# Altium schematic sheet Sound_Card_LED_Monitor.SchDoc: Sound Card LED Monitor
size Tabloid; Date: 05/10/2023; Engineer: Terry D. Schevker; Revision: 1.0; SheetNumber: 4; SheetTotal: 4
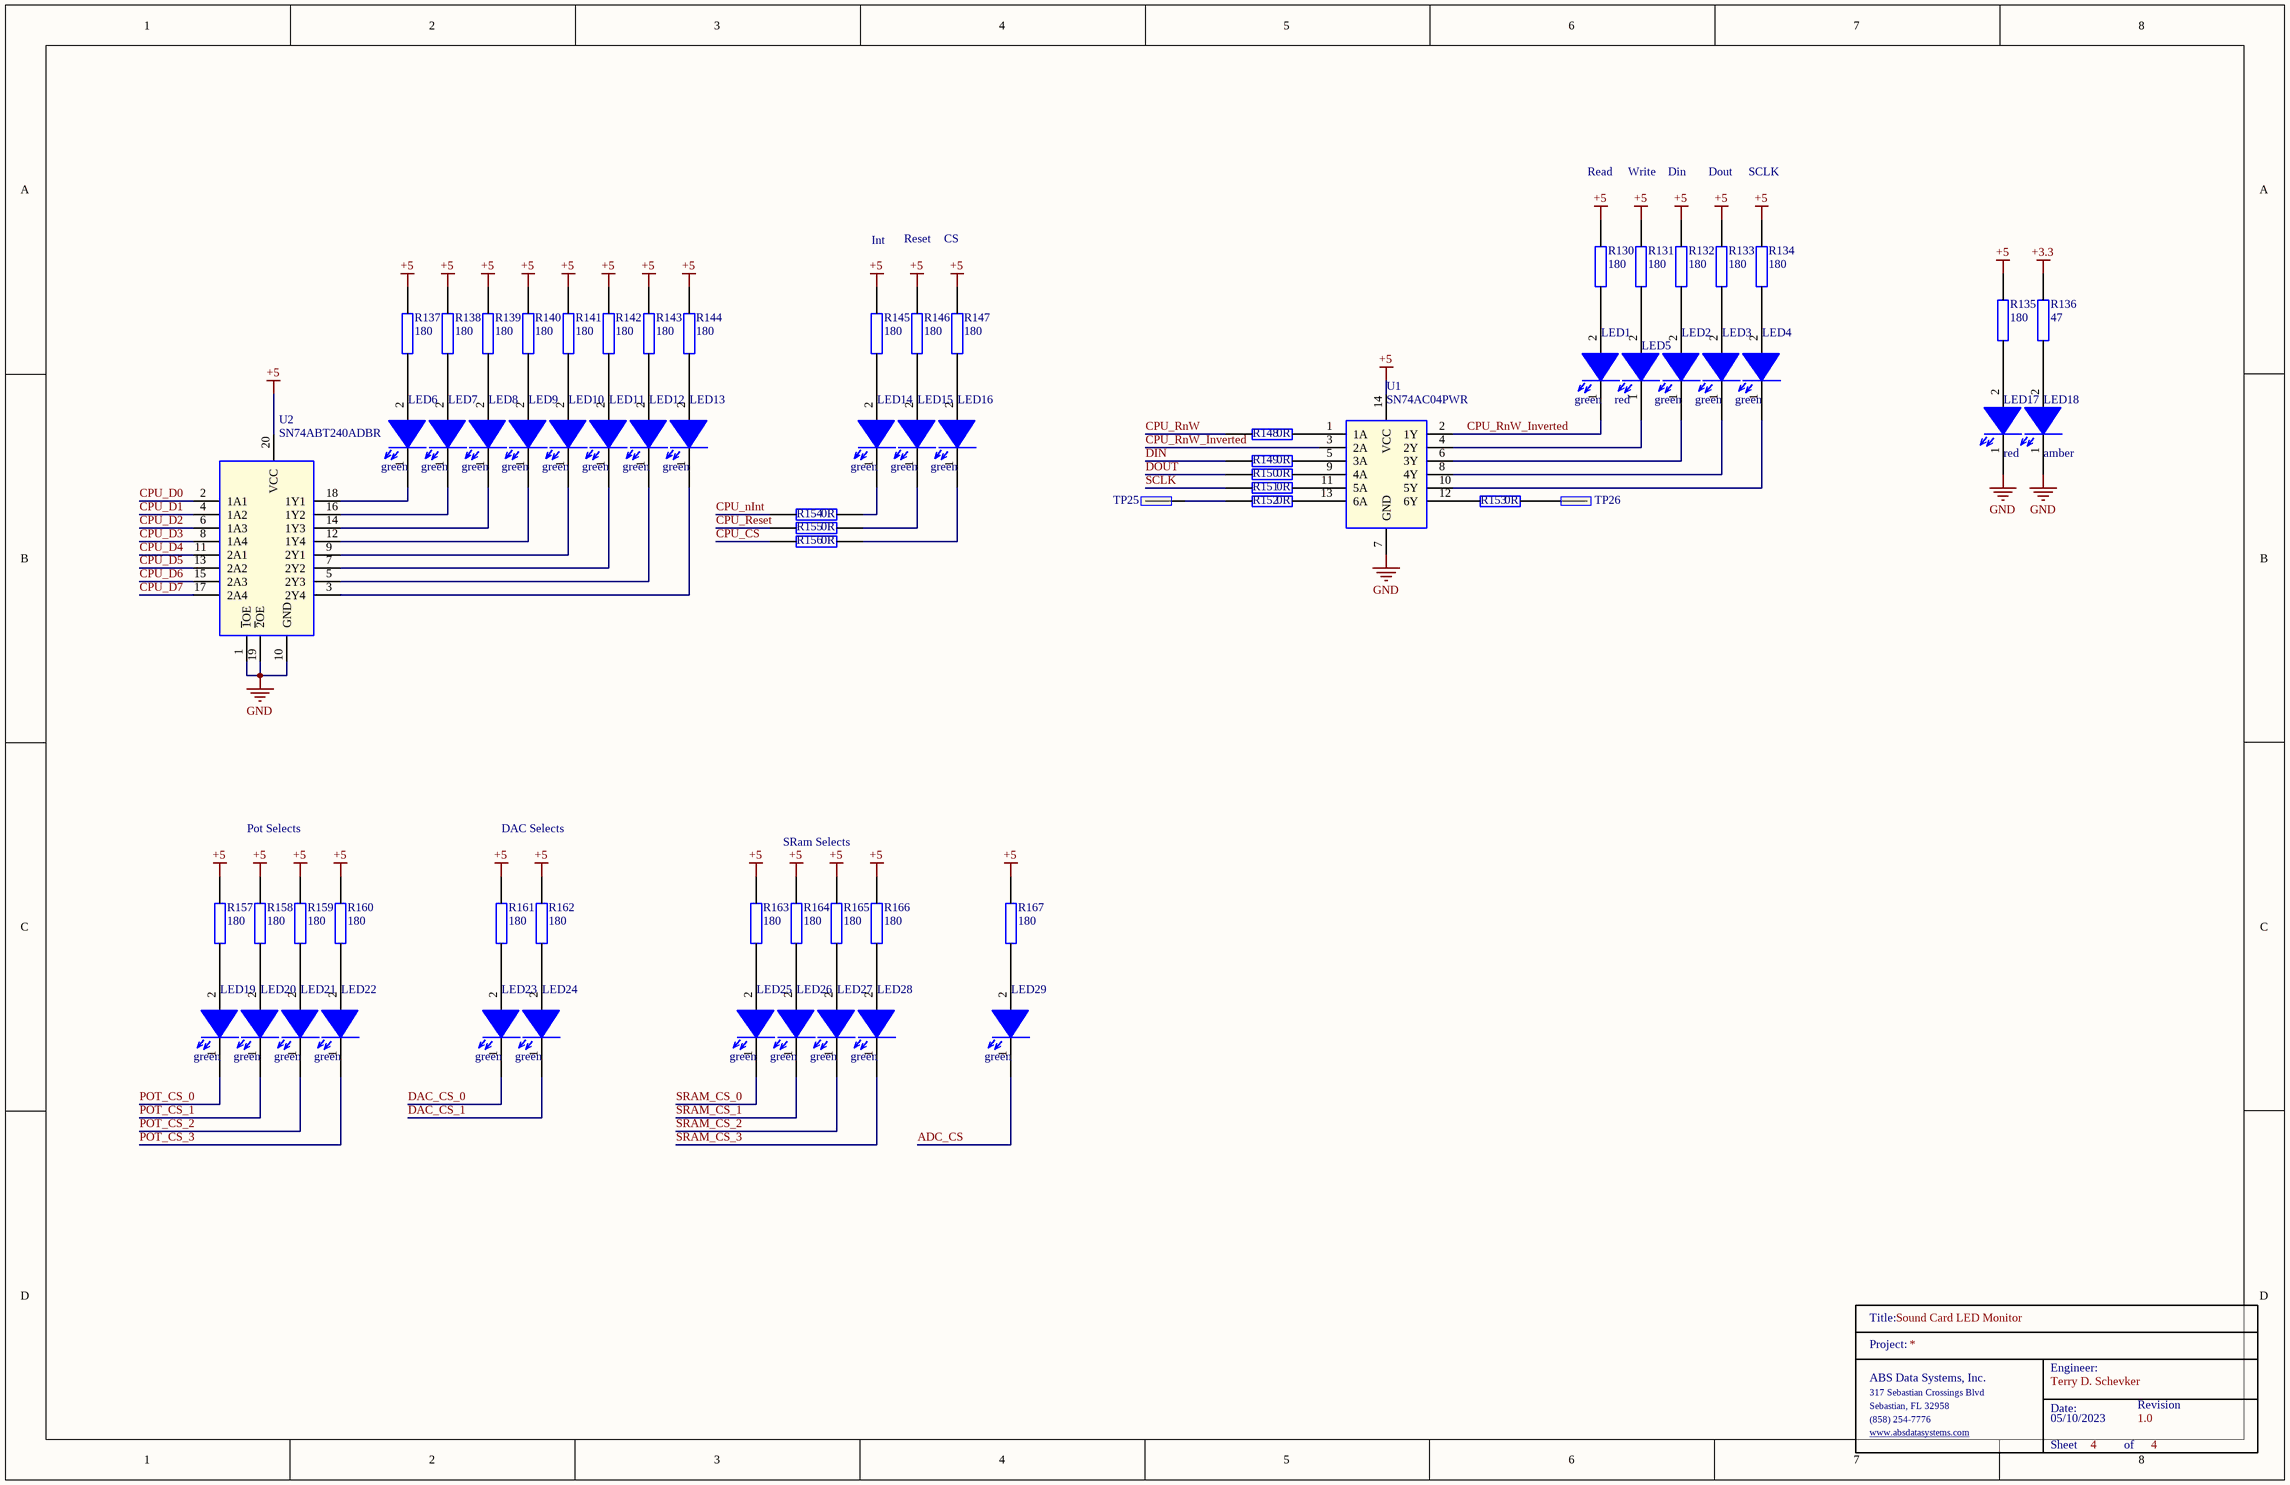
[diagram p0: Sound_Card_LED_Monitor.SchDoc]

## Parts
LED1  green  [0603_Diode]
LED2  green  [0603_Diode]
LED3  green  [0603_Diode]
LED4  green  [0603_Diode]
LED5  red  [0603_Diode]
LED6  green  [0603_Diode]
LED7  green  [0603_Diode]
LED8  green  [0603_Diode]
LED9  green  [0603_Diode]
LED10  green  [0603_Diode]
LED11  green  [0603_Diode]
LED12  green  [0603_Diode]
LED13  green  [0603_Diode]
LED14  green  [0603_Diode]
LED15  green  [0603_Diode]
LED16  green  [0603_Diode]
LED17  red  [0603_Diode]
LED18  amber  [0603_Diode]
LED19  green  [0603_Diode]
LED20  green  [0603_Diode]
LED21  green  [0603_Diode]
LED22  green  [0603_Diode]
LED23  green  [0603_Diode]
LED24  green  [0603_Diode]
LED25  green  [0603_Diode]
LED26  green  [0603_Diode]
LED27  green  [0603_Diode]
LED28  green  [0603_Diode]
LED29  green  [0603_Diode]
R130  180  [0603]
R131  180  [0603]
R132  180  [0603]
R133  180  [0603]
R134  180  [0603]
R135  180  [0603]
R136  47  [0603]
R137  180  [0603]
R138  180  [0603]
R139  180  [0603]
R140  180  [0603]
R141  180  [0603]
R142  180  [0603]
R143  180  [0603]
R144  180  [0603]
R145  180  [0603]
R146  180  [0603]
R147  180  [0603]
R148  0R  [0603]
R149  0R  [0603]
R150  0R  [0603]
R151  0R  [0603]
R152  0R  [0603]
R153  0R  [0603]
R154  0R  [0603]
R155  0R  [0603]
R156  0R  [0603]
R157  180  [0603]
R158  180  [0603]
R159  180  [0603]
R160  180  [0603]
R161  180  [0603]
R162  180  [0603]
R163  180  [0603]
R164  180  [0603]
R165  180  [0603]
R166  180  [0603]
R167  180  [0603]
TitleBlock_?  TitleBlock  (value not drawn)  (graphical)
TP25  TP  [TP]  (value not drawn)
TP26  TP  [TP]  (value not drawn)
U1  SN74AC04PWR  [SOP65P640X120-14N]
U2  SN74ABT240ADBR  [SOP65P780X200-20N]

## Nets
+3.3: R136.1
+5: R130.2 R131.2 R132.2 R133.2 R134.2 R135.2 R137.2 R138.2 R139.2 R140.2 R141.2 R142.2 R143.2 R144.2 R145.2 R146.2 R147.2 R157.2 R158.2 R159.2 R160.2 R161.2 R162.2 R163.2 R164.2 R165.2 R166.2 R167.2 U1.14(VCC) U2.20(VCC)
GND: LED17.1(K) LED18.1(K) U1.7(GND) U2.1(~{1}OE) U2.10(GND) U2.19(~{2}OE)
ADC_CS: LED29.1(K)
CPU_CS: R156.1
CPU_D0: U2.2(1A1)
CPU_D1: U2.4(1A2)
CPU_D2: U2.6(1A3)
CPU_D3: U2.8(1A4)
CPU_D4: U2.11(2A1)
CPU_D5: U2.13(2A2)
CPU_D6: U2.15(2A3)
CPU_D7: U2.17(2A4)
CPU_nInt: R154.1
CPU_Reset: R155.1
CPU_RnW: R148.1
CPU_RnW_Inverted: LED1.1(K) U1.2(1Y) U1.3(2A)
DAC_CS_0: LED23.1(K)
DAC_CS_1: LED24.1(K)
DIN: R149.1
DOUT: R150.1
POT_CS_0: LED19.1(K)
POT_CS_1: LED20.1(K)
POT_CS_2: LED21.1(K)
POT_CS_3: LED22.1(K)
SCLK: R151.1
SRAM_CS_0: LED25.1(K)
SRAM_CS_1: LED26.1(K)
SRAM_CS_2: LED27.1(K)
SRAM_CS_3: LED28.1(K)
NetLED1_2: LED1.2(A) R130.1
NetLED2_1: LED2.1(K) U1.6(3Y)
NetLED2_2: LED2.2(A) R132.1
NetLED3_1: LED3.1(K) U1.8(4Y)
NetLED3_2: LED3.2(A) R133.1
NetLED4_1: LED4.1(K) U1.10(5Y)
NetLED4_2: LED4.2(A) R134.1
NetLED5_1: LED5.1(K) U1.4(2Y)
NetLED5_2: LED5.2(A) R131.1
NetLED6_1: LED6.1(K) U2.18(1Y1)
NetLED6_2: LED6.2(A) R137.1
NetLED7_1: LED7.1(K) U2.16(1Y2)
NetLED7_2: LED7.2(A) R138.1
NetLED8_1: LED8.1(K) U2.14(1Y3)
NetLED8_2: LED8.2(A) R139.1
NetLED9_1: LED9.1(K) U2.12(1Y4)
NetLED9_2: LED9.2(A) R140.1
NetLED10_1: LED10.1(K) U2.9(2Y1)
NetLED10_2: LED10.2(A) R141.1
NetLED11_1: LED11.1(K) U2.7(2Y2)
NetLED11_2: LED11.2(A) R142.1
NetLED12_1: LED12.1(K) U2.5(2Y3)
NetLED12_2: LED12.2(A) R143.1
NetLED13_1: LED13.1(K) U2.3(2Y4)
NetLED13_2: LED13.2(A) R144.1
NetLED14_1: LED14.1(K) R154.2
NetLED14_2: LED14.2(A) R145.1
NetLED15_1: LED15.1(K) R155.2
NetLED15_2: LED15.2(A) R146.1
NetLED16_1: LED16.1(K) R156.2
NetLED16_2: LED16.2(A) R147.1
NetLED17_2: LED17.2(A) R135.1
NetLED18_2: LED18.2(A) R136.2
NetLED19_2: LED19.2(A) R157.1
NetLED20_2: LED20.2(A) R158.1
NetLED21_2: LED21.2(A) R159.1
NetLED22_2: LED22.2(A) R160.1
NetLED23_2: LED23.2(A) R161.1
NetLED24_2: LED24.2(A) R162.1
NetLED25_2: LED25.2(A) R163.1
NetLED26_2: LED26.2(A) R164.1
NetLED27_2: LED27.2(A) R165.1
NetLED28_2: LED28.2(A) R166.1
NetLED29_2: LED29.2(A) R167.1
NetR148_2: R148.2 U1.1(1A)
NetR149_2: R149.2 U1.5(3A)
NetR150_2: R150.2 U1.9(4A)
NetR151_2: R151.2 U1.11(5A)
NetR152_1: R152.1 TP25.1
NetR152_2: R152.2 U1.13(6A)
NetR153_1: R153.1 U1.12(6Y)
NetR153_2: R153.2 TP26.1

## Notes on the sheet
- Read
- Write
- Din
- Dout
- SCLK
- Int
- Reset
- CS
- Pot Selects
- DAC Selects
- SRam Selects
- (in symbol TitleBlock) Title:; Project:; Engineer:; ABS Data Systems, Inc.; 317 Sebastian Crossings Blvd; Sebastian, FL 32958; Date:; Revision; (858) 254-7776; www.absdatasystems.com; Sheet; of

## Library data of the parts
LED1-LED4 LED6-LED16 LED19-LED29 = 150060GS75000: Wurth Elektronik 0603 green; Manufacturer: Wurth Electronics; Wavelength: 520nm; Viewing Angle: 140°; Lens Style: Clear,Rectangular; Luminous Intensity: 430mcd; Forward Current: 30mA; Forward Voltage: 3.2V; Test Current: 20mA; Supplier 1: Digi-Key; Manufacturer Part Number: 150060GS75000; RoHS: Yes; Category: LEDs; Stock 1: 71509; Pricing 1: 1=0.14000, 50=0.13300, 100=0.11400, 500=0.09900 (USD); Mount: Surface Mount; Case/Package: 0603; Color: Green; Case Code (Metric): 1608; Case Code (Imperial): 0603; Min Operating Temperature: -40°C; Max Operating Temperature: 85°C; Package Quantity: 4000; Packaging: Tape and Reel; Dominant Wavelength: 520nm; Length: 1.6mm; Width: 0.8mm; Height: 0.7mm; REACH SVHC: Unknown; Lead Free: Lead Free; ComponentLink1URL: https://datasheet.ciiva.com/29562/150060gs75000-29562868.pdf?src-supplier=Digi-Key; ComponentLink1Description: https://datasheet.ciiva.com/29562/150060gs75000-29562868.pdf?src-supplier=Digi-Key; ComponentLink2URL: https://datasheet.ciiva.com/29279/759427-da-01-en-chipled-0603-w-kl-gruen-150060gs75000-29279201.pdf?src-supplier=Conrad; ComponentLink2Description: https://datasheet.ciiva.com/29279/759427-da-01-en-chipled-0603-w-kl-gruen-150060gs75000-29279201.pdf?src-supplier=Conrad; ComponentLink3URL: https://datasheet.ciiva.com/29562/150060gs75000-29562869.pdf?src-supplier=Digi-Key; ComponentLink3Description: https://datasheet.ciiva.com/29562/150060gs75000-29562869.pdf?src-supplier=Digi-Key; ComponentLink4URL: https://datasheet.ciiva.com/29562/150060gs75000-29562870.pdf?src-supplier=Digi-Key; ComponentLink4Description: https://datasheet.ciiva.com/29562/150060gs75000-29562870.pdf?src-supplier=Digi-Key
LED5 LED17 = 150060RS75000: Wurth Elektronik 0603 red; Manufacturer: Wurth Electronics; Manufacturer Part Number: 150060GS75000; Color: Green; Wavelength: 520nm; Viewing Angle: 140°; Lens Style: Clear,Rectangular; Luminous Intensity: 430mcd; Forward Current: 30mA; Forward Voltage: 3.2V; Test Current: 20mA; Supplier 1: Digi-Key; RoHS: Yes; Category: LEDs; Stock 1: 71509; Pricing 1: 1=0.14000, 50=0.13300, 100=0.11400, 500=0.09900 (USD); Mount: Surface Mount; Case/Package: 0603; Case Code (Metric): 1608; Case Code (Imperial): 0603; Min Operating Temperature: -40°C; Max Operating Temperature: 85°C; Package Quantity: 4000; Packaging: Tape and Reel; Dominant Wavelength: 520nm; Length: 1.6mm; Width: 0.8mm; Height: 0.7mm; REACH SVHC: Unknown; Lead Free: Lead Free; ComponentLink1URL: https://datasheet.ciiva.com/29562/150060gs75000-29562868.pdf?src-supplier=Digi-Key; ComponentLink1Description: https://datasheet.ciiva.com/29562/150060gs75000-29562868.pdf?src-supplier=Digi-Key; ComponentLink2URL: https://datasheet.ciiva.com/29279/759427-da-01-en-chipled-0603-w-kl-gruen-150060gs75000-29279201.pdf?src-supplier=Conrad; ComponentLink2Description: https://datasheet.ciiva.com/29279/759427-da-01-en-chipled-0603-w-kl-gruen-150060gs75000-29279201.pdf?src-supplier=Conrad; ComponentLink3URL: https://datasheet.ciiva.com/29562/150060gs75000-29562869.pdf?src-supplier=Digi-Key; ComponentLink3Description: https://datasheet.ciiva.com/29562/150060gs75000-29562869.pdf?src-supplier=Digi-Key; ComponentLink4URL: https://datasheet.ciiva.com/29562/150060gs75000-29562870.pdf?src-supplier=Digi-Key; ComponentLink4Description: https://datasheet.ciiva.com/29562/150060gs75000-29562870.pdf?src-supplier=Digi-Key
LED18 = 150060AS75000: Wurth Elektronik 0603 amber; Manufacturer: Wurth Electronics; Manufacturer Part Number: 150060GS75000; Color: Green; Wavelength: 520nm; Viewing Angle: 140°; Lens Style: Clear,Rectangular; Luminous Intensity: 430mcd; Forward Current: 30mA; Forward Voltage: 3.2V; Test Current: 20mA; Supplier 1: Digi-Key; RoHS: Yes; Category: LEDs; Stock 1: 71509; Pricing 1: 1=0.14000, 50=0.13300, 100=0.11400, 500=0.09900 (USD); Mount: Surface Mount; Case/Package: 0603; Case Code (Metric): 1608; Case Code (Imperial): 0603; Min Operating Temperature: -40°C; Max Operating Temperature: 85°C; Package Quantity: 4000; Packaging: Tape and Reel; Dominant Wavelength: 520nm; Length: 1.6mm; Width: 0.8mm; Height: 0.7mm; REACH SVHC: Unknown; Lead Free: Lead Free; ComponentLink1URL: https://datasheet.ciiva.com/29562/150060gs75000-29562868.pdf?src-supplier=Digi-Key; ComponentLink1Description: https://datasheet.ciiva.com/29562/150060gs75000-29562868.pdf?src-supplier=Digi-Key; ComponentLink2URL: https://datasheet.ciiva.com/29279/759427-da-01-en-chipled-0603-w-kl-gruen-150060gs75000-29279201.pdf?src-supplier=Conrad; ComponentLink2Description: https://datasheet.ciiva.com/29279/759427-da-01-en-chipled-0603-w-kl-gruen-150060gs75000-29279201.pdf?src-supplier=Conrad; ComponentLink3URL: https://datasheet.ciiva.com/29562/150060gs75000-29562869.pdf?src-supplier=Digi-Key; ComponentLink3Description: https://datasheet.ciiva.com/29562/150060gs75000-29562869.pdf?src-supplier=Digi-Key; ComponentLink4URL: https://datasheet.ciiva.com/29562/150060gs75000-29562870.pdf?src-supplier=Digi-Key; ComponentLink4Description: https://datasheet.ciiva.com/29562/150060gs75000-29562870.pdf?src-supplier=Digi-Key
R130-R135 R137-R147 R157-R167 = RC0603FR-13180RL: YAGEO 0603 180 ohm; Manufacturer_Name: KEMET; Manufacturer_Part_Number: RC0603JR-070RL; Geometry.Height: 0.55mm; Mouser Part Number: 603-RC0603JR-070RL; Mouser Price/Stock: https://www.mouser.co.uk/ProductDetail/YAGEO/RC0603JR-070RL?qs=2cAdsCoAWRGWyPcuXgGiXQ%3D%3D; Datasheet Link: https://datasheet.datasheetarchive.com/originals/distributors/Datasheets_SAMA/902f9e387b938f871d31120f5fc1d65e.pdf
R136 = RC0603FR-0747KL: YAGEO 0603 47; Manufacturer_Name: KEMET; Manufacturer_Part_Number: RC0603JR-070RL; Geometry.Height: 0.55mm; Mouser Part Number: 603-RC0603JR-070RL; Mouser Price/Stock: https://www.mouser.co.uk/ProductDetail/YAGEO/RC0603JR-070RL?qs=2cAdsCoAWRGWyPcuXgGiXQ%3D%3D; Datasheet Link: https://datasheet.datasheetarchive.com/originals/distributors/Datasheets_SAMA/902f9e387b938f871d31120f5fc1d65e.pdf
R148-R156 = RC0603JR-070RL: YAGEO 0603 0 ohm; Manufacturer_Name: KEMET; Geometry.Height: 0.55mm; Mouser Part Number: 603-RC0603JR-070RL; Mouser Price/Stock: https://www.mouser.co.uk/ProductDetail/YAGEO/RC0603JR-070RL?qs=2cAdsCoAWRGWyPcuXgGiXQ%3D%3D; Manufacturer_Part_Number: RC0603JR-070RL; Datasheet Link: https://datasheet.datasheetarchive.com/originals/distributors/Datasheets_SAMA/902f9e387b938f871d31120f5fc1d65e.pdf
TP25 TP26 = TP: Manufacturer: Samtec; Manufacturer Part Number: TST-105-01-G-D; Number of Contacts: 16; Gender: Male; Connector Type: Male Pin; Pitch: 2.54mm; Row Spacing: 0.1inch; Supplier 1: Digi-Key; RoHS: Yes; Category: Headers and Wire Housings; Stock 1: 227; Pricing 1: 1=2.85000, 10=2.73600, 100=2.28000, 500=1.93800, 1000=1.65300, 5000=1.48200 (USD); Mount: Through Hole; Contact Plating: Gold; Contact Material: Bronze; Housing Material: Polyester; Housing Color: Black; Color: Black; Min Operating Temperature: -55°C; Max Operating Temperature: 125°C; Number of Rows: 2; Termination: Solder; Packaging: Rail/Tube; Orientation: Straight; Number of Positions: 16; Length: 27.94mm; Depth: 9.27mm; Contact Mating Length: 0.25inch; REACH SVHC: No SVHC; ComponentLink1URL: https://datasheet.ciiva.com/739/tst-mkt-739845.pdf?src-supplier=Digi-Key; ComponentLink1Description: https://datasheet.ciiva.com/739/tst-mkt-739845.pdf?src-supplier=Digi-Key; ComponentLink2URL: https://datasheet.ciiva.com/10018/htst-10018510.pdf?src-supplier=Avnet; ComponentLink2Description: https://datasheet.ciiva.com/10018/htst-10018510.pdf?src-supplier=Avnet
U1 = SN74AC04PWR: Hex Inverters; Manufacturer_Name: Texas Instruments; Geometry.Height: 1.2mm; Mouser Part Number: 595-SN74AC04PWR; Mouser Price/Stock: https://www.mouser.co.uk/ProductDetail/Texas-Instruments/SN74AC04PWR?qs=RZS%252BpEsUn7pRvPNqsga4SA%3D%3D; Manufacturer_Part_Number: SN74AC04PWR; Datasheet Link: http://www.ti.com/lit/gpn/sn74ac04
U2 = SN74ABT240ADBR: Octal Buffers/Drivers With 3-State Outputs; Manufacturer_Name: Texas Instruments; Geometry.Height: 2mm; Mouser Part Number: 595-SN74ABT240ADBR; Mouser Price/Stock: https://www.mouser.co.uk/ProductDetail/Texas-Instruments/SN74ABT240ADBR?qs=JHHQeKcAU3Dt82k%252BVyiYdw%3D%3D; Manufacturer_Part_Number: SN74ABT240ADBR; Datasheet Link: http://www.ti.com/lit/gpn/sn74abt240a